# EAGLE schematic stopky (EAGLE 9.0.1)
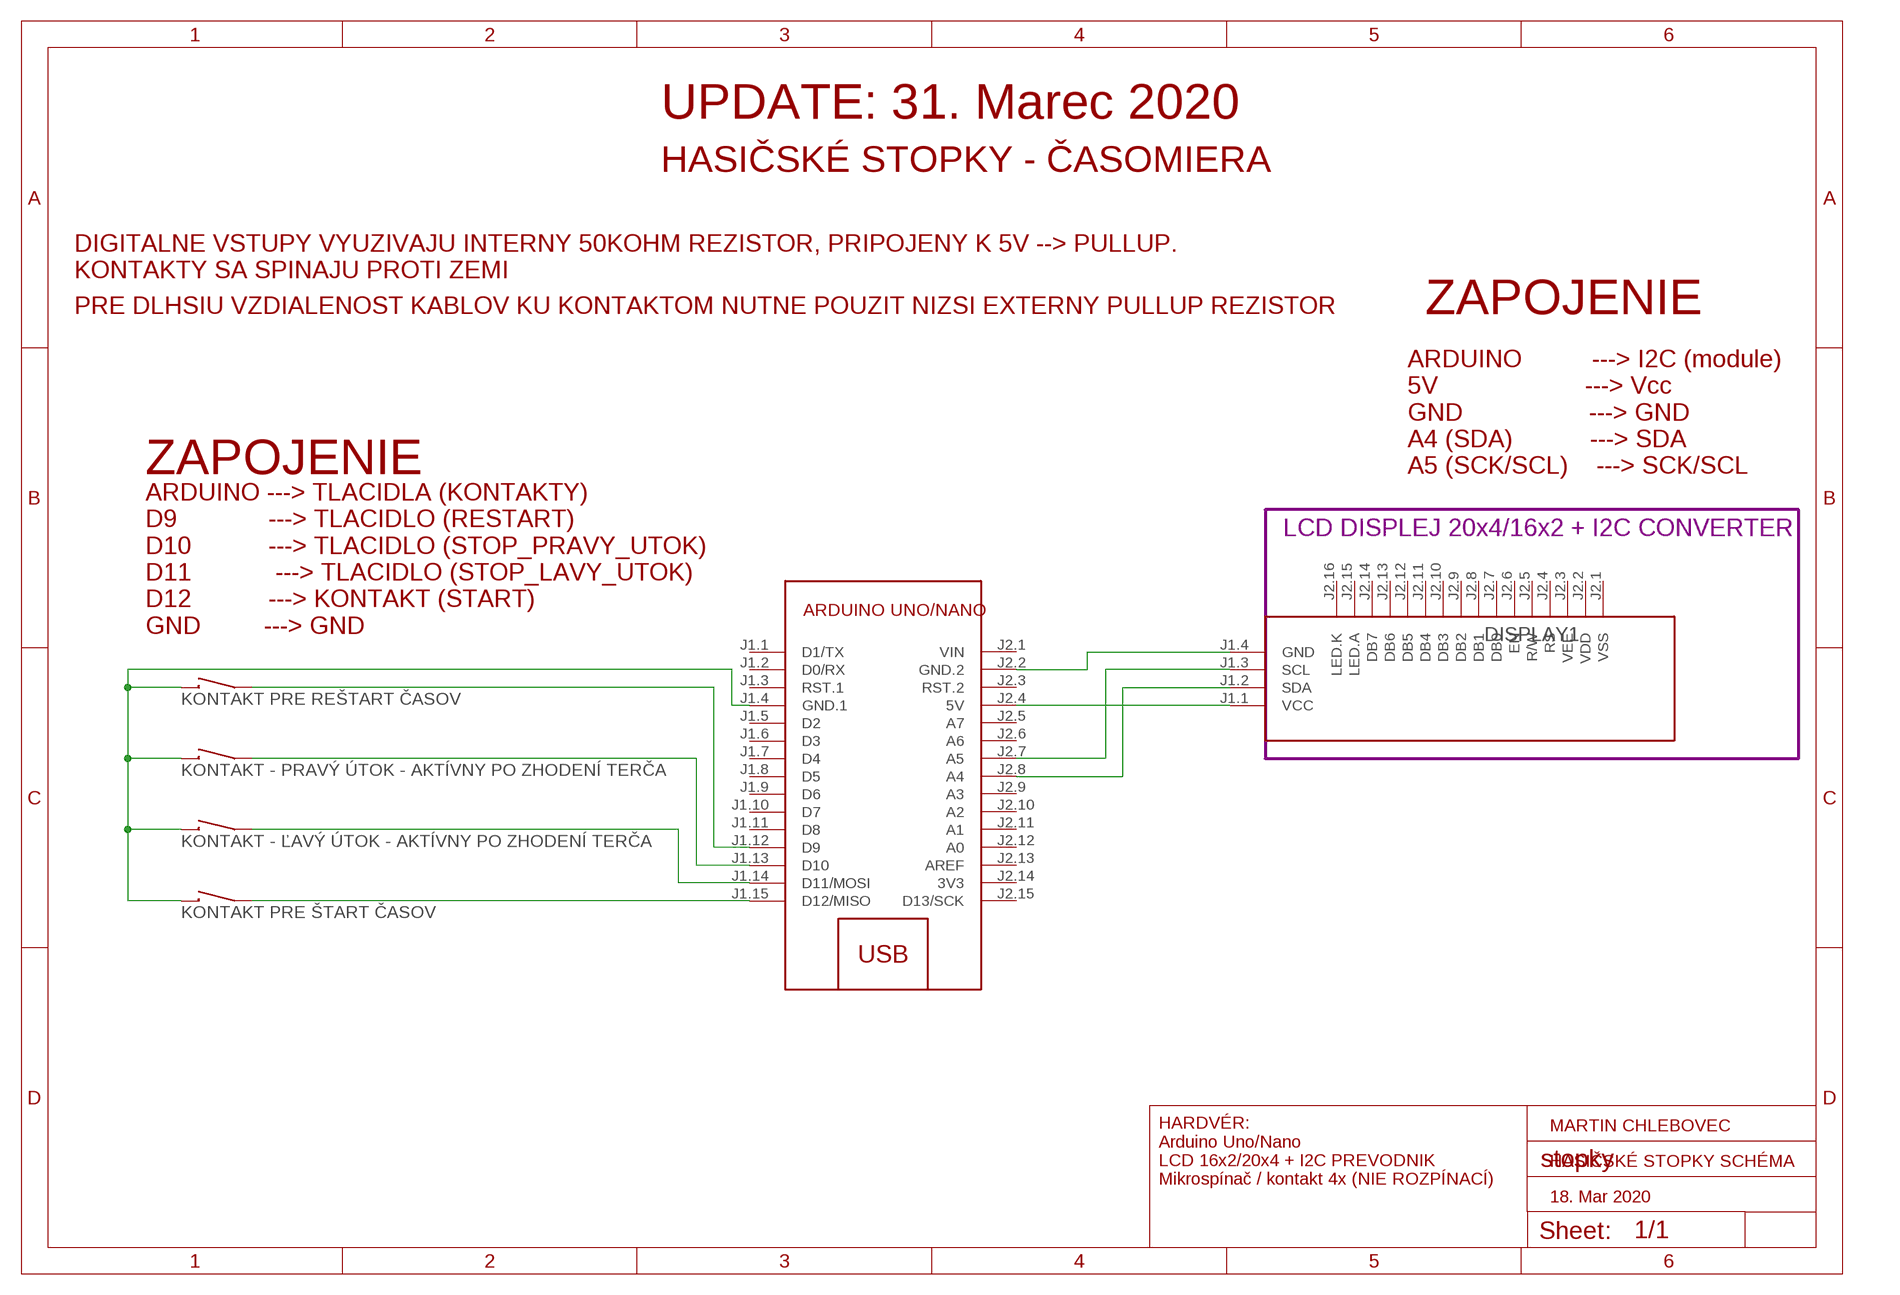
[diagram p0: schematic, sheet 1]

## Parts
M1  ARDUINO-NANO-3.0  [ARDUINO-NANO-3.0]
TLACIDLO_PRE_SPUSTENIE_ZASTAVENIE  FINGERPAD-2B  [FINGERPAD-2B]
TLACIDLO_PRE_SPUSTENIE_ZASTAVENIE1  FINGERPAD-2B  [FINGERPAD-2B]
TLACIDLO_PRE_SPUSTENIE_ZASTAVENIE2  FINGERPAD-2B  [FINGERPAD-2B]
TLACIDLO_PRE_SPUSTENIE_ZASTAVENIE3  FINGERPAD-2B  [FINGERPAD-2B]
U$1  LCD-I2C-CONVERTER  [LCD-I2C-CONVERTER]

## Module instances
DISPLAY1 = DISPLAY

## Nets
N$1: M1.J1.15(D12/MISO) TLACIDLO_PRE_SPUSTENIE_ZASTAVENIE.1
N$2: M1.J1.14(D11/MOSI) TLACIDLO_PRE_SPUSTENIE_ZASTAVENIE2.1
N$3: M1.J1.13(D10) TLACIDLO_PRE_SPUSTENIE_ZASTAVENIE1.1
N$4: M1.J1.12(D9) TLACIDLO_PRE_SPUSTENIE_ZASTAVENIE3.1
N$5: M1.J1.4(GND.1) TLACIDLO_PRE_SPUSTENIE_ZASTAVENIE1.2 TLACIDLO_PRE_SPUSTENIE_ZASTAVENIE2.2 TLACIDLO_PRE_SPUSTENIE_ZASTAVENIE3.2 TLACIDLO_PRE_SPUSTENIE_ZASTAVENIE.2
N$6: M1.J2.4(5V) U$1.J1.1(VCC)
N$7: M1.J2.2(GND.2) U$1.J1.4(GND)
N$8: M1.J2.8(A4) U$1.J1.2(SDA)
N$9: M1.J2.7(A5) U$1.J1.3(SCL)
Unconnected: M1.J1.1(D1/TX) M1.J1.2(D0/RX) M1.J1.3(RST.1) M1.J1.5(D2) M1.J1.6(D3) M1.J1.7(D4) M1.J1.8(D5) M1.J1.9(D6) M1.J1.10(D7) M1.J1.11(D8) M1.J2.3(RST.2) M1.J2.5(A7) M1.J2.6(A6) M1.J2.9(A3) M1.J2.10(A2) M1.J2.11(A1) M1.J2.12(A0) M1.J2.13(AREF) M1.J2.15(D13/SCK) U$1.J2.1(VSS) U$1.J2.2(VDD) U$1.J2.3(VEE) U$1.J2.4(RS) U$1.J2.5(R/W) U$1.J2.6(EN) U$1.J2.7(DB0) U$1.J2.8(DB1) U$1.J2.9(DB2) U$1.J2.10(DB3) U$1.J2.11(DB4) U$1.J2.12(DB5) U$1.J2.13(DB6) U$1.J2.14(DB7) U$1.J2.15(LED.A) U$1.J2.16(LED.K)

## Notes on the sheet
- UPDATE: 31. Marec 2020
- HASIČSKÉ STOPKY - ČASOMIERA
- DIGITALNE VSTUPY VYUZIVAJU INTERNY 50KOHM REZISTOR, PRIPOJENY K 5V --> PULLUP.
  KONTAKTY SA SPINAJU PROTI ZEMI
- PRE DLHSIU VZDIALENOST KABLOV KU KONTAKTOM NUTNE POUZIT NIZSI EXTERNY PULLUP REZISTOR | ZAPOJENIE
- ZAPOJENIE
- ARDUINO          ---> I2C (module)
  5V                     ---> Vcc
  GND                  ---> GND
  A4 (SDA)           ---> SDA
  A5 (SCK/SCL)    ---> SCK/SCL
- LCD DISPLEJ 20x4/16x2 + I2C CONVERTER
- ARDUINO UNO/NANO
- ARDUINO ---> TLACIDLA (KONTAKTY)
  D9             ---> TLACIDLO (RESTART)
  D10           ---> TLACIDLO (STOP_PRAVY_UTOK)
  D11            ---> TLACIDLO (STOP_LAVY_UTOK)
  D12           ---> KONTAKT (START)
  GND         ---> GND
- KONTAKT PRE REŠTART ČASOV
- KONTAKT - PRAVÝ ÚTOK - AKTÍVNY PO ZHODENÍ TERČA
- KONTAKT - ĽAVÝ ÚTOK - AKTÍVNY PO ZHODENÍ TERČA
- KONTAKT PRE ŠTART ČASOV
- MARTIN CHLEBOVEC
- HASIČSKÉ STOPKY SCHÉMA
- HARDVÉR:
  Arduino Uno/Nano
  LCD 16x2/20x4 + I2C PREVODNIK
  Mikrospínač / kontakt 4x (NIE ROZPÍNACÍ)
- 18. Mar 2020

## Power pins joined to a net without a drawn wire
3V3: M1.J2.14(3V3)
VIN: M1.J2.1(VIN)

## Library data of the parts
M1 = diy-modules (1):ARDUINO-NANO-3.0: Arduino Nano 3.0 and compatible devices More details available here: https://www.arduino.cc/en/Main/ArduinoBoardNano Click here to find device on ebay.com <http://www.ebay.com/sch/arduino+nano>
TLACIDLO_PRE_SPUSTENIE_ZASTAVENIE TLACIDLO_PRE_SPUSTENIE_ZASTAVENIE1-TLACIDLO_PRE_SPUSTENIE_ZASTAVENIE3 = dom-key:FINGERPAD-2B: Source: http://www.polycase.com/uploads/14531129045666549.pdf
U$1 = diy-modules (1):LCD-I2C-CONVERTER: I2C Bus to 4-Bit Parallel LCD Interface with LED backlight driver

## Module DISPLAY
Ports: 

### Library data of the parts